# Altium schematic sheet rv_pwr_es_sensor.SchDoc: RV Essential: Sensors and IO
size A4; DocumentNumber: 4; Revision: A; SheetNumber: 4; SheetTotal: 5
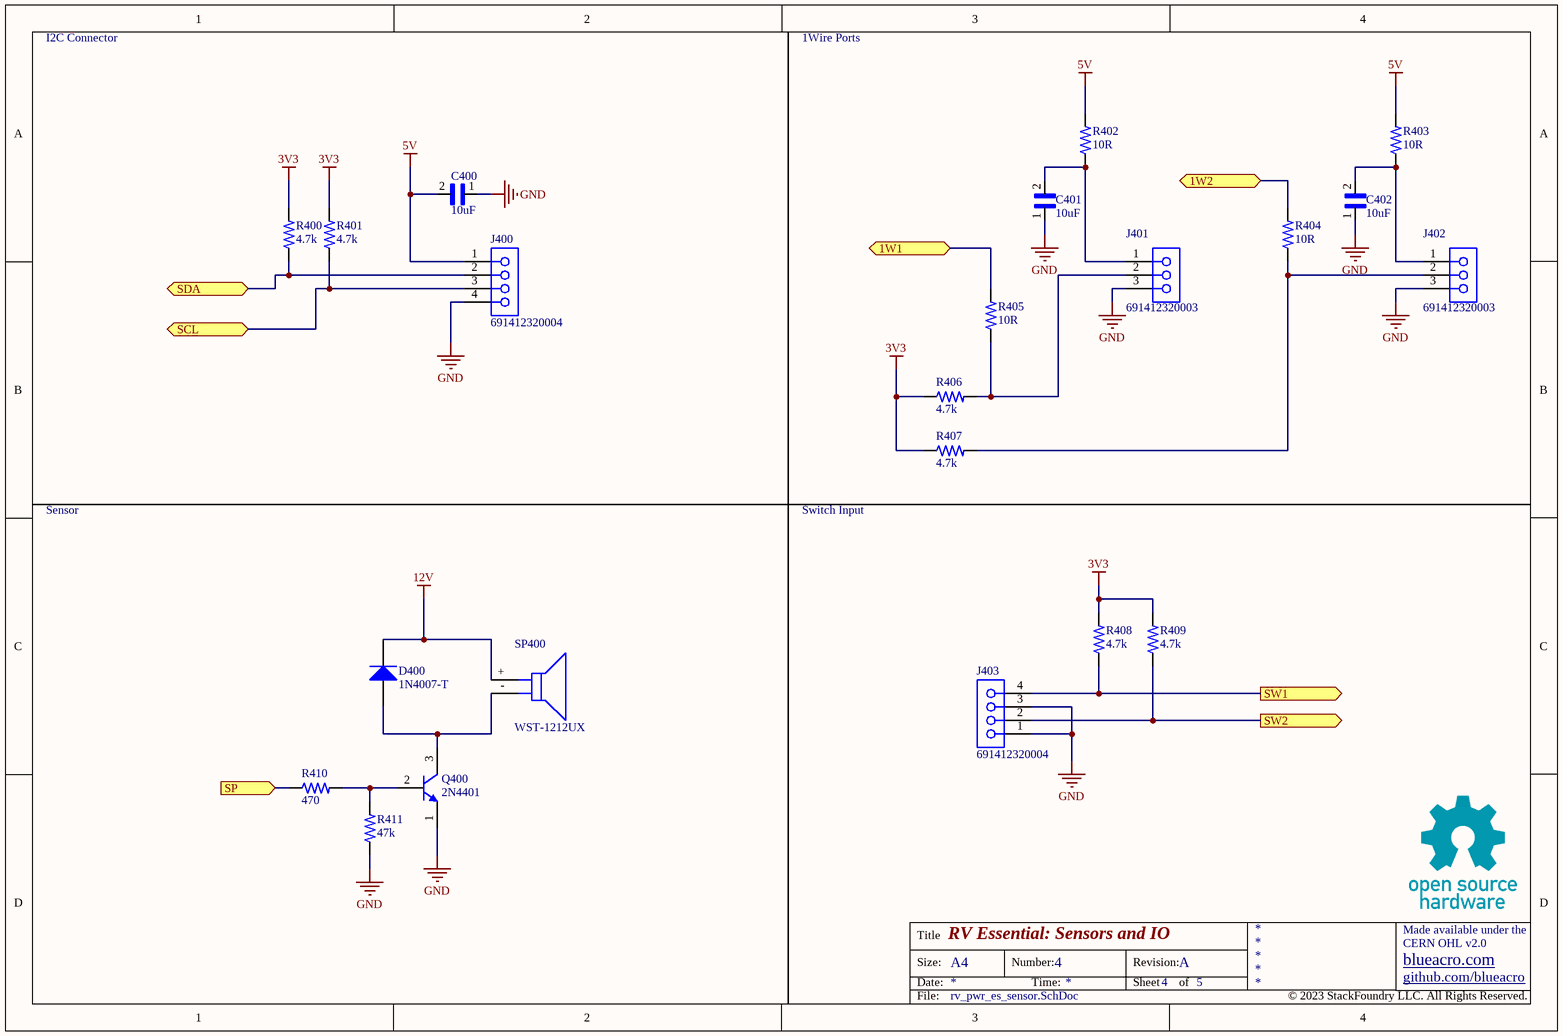
[diagram p0: rv_pwr_es_sensor.SchDoc]

## Parts
C400  value 10uF  [CAPRB250W50L550T350H600]  (hidden comment: FG16X7R1E106KRT06)
C401  value 10uF  [CAPRB250W50L550T350H600]  (hidden comment: FG16X7R1E106KRT06)
C402  value 10uF  [CAPRB250W50L550T350H600]  (hidden comment: FG16X7R1E106KRT06)
D400  1N4007-T  [DIOD-DO-41-P-2_V2]
J400  691412320004  [691412320004]
J401  691412320003  [691412320003]
J402  691412320003  [691412320003]
J403  691412320004  [691412320004]
Q400  2N4401  [ONSC-TO-92-3-29-11]
R400  value 4.7k  [0207/10 - Cloned]  (hidden comment: 4.7k TH 0207 5% 1/4W)
R401  value 4.7k  [0207/10 - Cloned]  (hidden comment: 4.7k TH 0207 5% 1/4W)
R402  value 10R  [0207/10]  (hidden comment: 10R TH 0207 5% 1/4W)
R403  value 10R  [0207/10]  (hidden comment: 10R TH 0207 5% 1/4W)
R404  value 10R  [0207/10]  (hidden comment: 10R TH 0207 5% 1/4W)
R405  value 10R  [0207/10]  (hidden comment: 10R TH 0207 5% 1/4W)
R406  value 4.7k  [0207/10 - Cloned]  (hidden comment: 4.7k TH 0207 5% 1/4W)
R407  value 4.7k  [0207/10 - Cloned]  (hidden comment: 4.7k TH 0207 5% 1/4W)
R408  value 4.7k  [0207/10 - Cloned]  (hidden comment: 4.7k TH 0207 5% 1/4W)
R409  value 4.7k  [0207/10 - Cloned]  (hidden comment: 4.7k TH 0207 5% 1/4W)
R410  value 470  [0207/10]  (hidden comment: 470 TH 0207 5% 0.25W)
R411  value 47k  [0207/10 - Cloned]  (hidden comment: 47k TH 0207 5% 1/4W)
SP400  WST-1212UX  [WST-1212UX-Footprint-1]

## Ports
1W1 (bidir), 1W2 (bidir), SCL (bidir), SDA (bidir), SP (in), SW1 (out), SW2 (out)

## Nets
3V3: R400.2 R401.2 R406.1 R407.1 R408.2 R409.2
5V: C400.2 J400.1 R402.2 R403.2
12V: D400.2(K) SP400.+
GND: C400.1 C401.1 C402.1 J400.4 J401.3 J402.3 J403.1 J403.3 Q400.1(E) R411.1
1W1: R405.2 ; port 1W1
1W2: R404.2 ; port 1W2
SCL: J400.3 R401.1 ; port SCL
SDA: J400.2 R400.1 ; port SDA
SP: R410.1 ; port SP
SW1: J403.4 R408.1 ; port SW1
SW2: J403.2 R409.1 ; port SW2
NetC401_2: C401.2 J401.1 R402.1
NetC402_2: C402.2 J402.1 R403.1
NetD400_1: D400.1(A) Q400.3(C) SP400.-
NetJ401_2: J401.2 R405.1 R406.2
NetJ402_2: J402.2 R404.1 R407.2
NetQ400_2: Q400.2(B) R410.2 R411.2

## Notes on the sheet
- I2C Connector
- 1Wire Ports
- Sensor
- Switch Input
- Title
- Size:
- Date:
- A4
- Number:
- Time:
- Revision:
- Sheet
- of
- github.com/blueacro
- blueacro.com
- CERN OHL v2.0
- Made available under the
- File:
- © 2023 StackFoundry LLC. All Rights Reserved.

## Library data of the parts
C400-C402 = CMP-233-000000-3: FG Series 10 uF 25 V ±10% Tolerance X7R Radial Multilayer Ceramic Capacitor; MF: TDK; Design Item ID: FG16X7R1E106KRT06; Source: FG16X7R1E106KRT06.SchLib; Component Type: Standard; Pin Count: 2; SnapEDA_Link: https://www.snapeda.com/parts/FG16X7R1E106KRT06/TDK/view-part/?ref=snap; Digi-Key_Part_Number: 445-173156-1-ND; MP: FG16X7R1E106KRT06; Purchase-URL: https://pricing.snapeda.com/search/part/FG16X7R1E106KRT06/?ref=eda; Check_prices: https://www.snapeda.com/parts/FG16X7R1E106KRT06/TDK/view-part/?ref=eda; Package: Radial TDK; Case/Package: Radial; Height - Seated (Max): 0.236inch; Lead Pitch: 0.098inch
D400 = CMP-004-00038-1: VR=1000V IF=1A 8pF
J400 J403 = CMP-002-00091-1: Tb, Wire To Brd, 4Way, 16Awg Rohs Compliant: Yes; Current: 4A; Color: Grey; Housing Material: Nylon; Contact Plating: Bronze,Tin
J401 J402 = CMP-002-00090-1: Tb, Wire To Brd, 3Way, 16Awg Rohs Compliant: Yes; Current: 4A; Color: Grey; Contact Plating: Bronze,Tin; Housing Material: Nylon
Q400 = CMP-013-00039-2: Transistor NPN Silicon 40V IC=600ma TO-92 Case General Purpose Amplifier And Switch; Collector Emitter Saturation Voltage: 750mV; MF: Rectron; Collector Base Voltage (VCBO): 60V; Package: TO-226-3 Rectron; Availability: In Stock; Value: *; Purchase-URL: https://pricing.snapeda.com/search/part/2N3904/?ref=eda; Case/Package: TO-92; Pin Count: 3; MP: 2N4401; Component Type: Standard; Design Item ID: 2N4401; Collector-emitter Voltage-Max: 40V; SnapEDA_Link: https://www.snapeda.com/parts/2N3904/Rectron/view-part/?ref=snap; Price: None
R400 R401 R406-R409 = CMP-009-00218-1: Res Carbon Film 4.7K Ohm 5% 1/4W -500ppm/°C to 350ppm/°C Conformal AXL Thru-Hole Paper T/R; Lead Diameter: 0.55mm; Diameter: 2.4mm; Case/Package: Axial; Contact Plating: Tin,Matte
R402-R405 = CMP-009-00219-1: Res Carbon Film 10 Ohm 5% 1/4W -500ppm/°C to 350ppm/°C Conformal AXL Thru-Hole Paper T/R; Lead Diameter: 0.55mm; Construction: Cylindrical; Contact Plating: Tin,Matte; Case/Package: Axial; Diameter: 2.4mm
R410 = CMP-009-00217-1: Res Carbon Film 470 Ohm 5% 1/4W -500ppm/°C to 350ppm/°C Conformal AXL Thru-Hole Paper T/R; Construction: Cylindrical; Diameter: 2.4mm; Case/Package: Conformal; Contact Plating: Tin,Matte
R411 = CMP-009-00220-1: Res Carbon Film 47K Ohm 5% 1/4W -500ppm/°C to 350ppm/°C Conformal AXL Thru-Hole Paper T/R; Lead Diameter: 0.55mm; Diameter: 2.4mm; Contact Plating: Tin,Matte; Case/Package: Axial
SP400 = CMP-00027-00003-3: Audio Magnetic Xdcr 9-15V Th; Frequency: 2.3kHz; Mounting Technology: Through Hole; Min Operating Temperature: -20°C; Max Operating Temperature: 60°C